# Altium schematic sheet 09_TFCARD&USB2.0.SchDoc
size A4; SheetNumber: 10; SheetTotal: 11
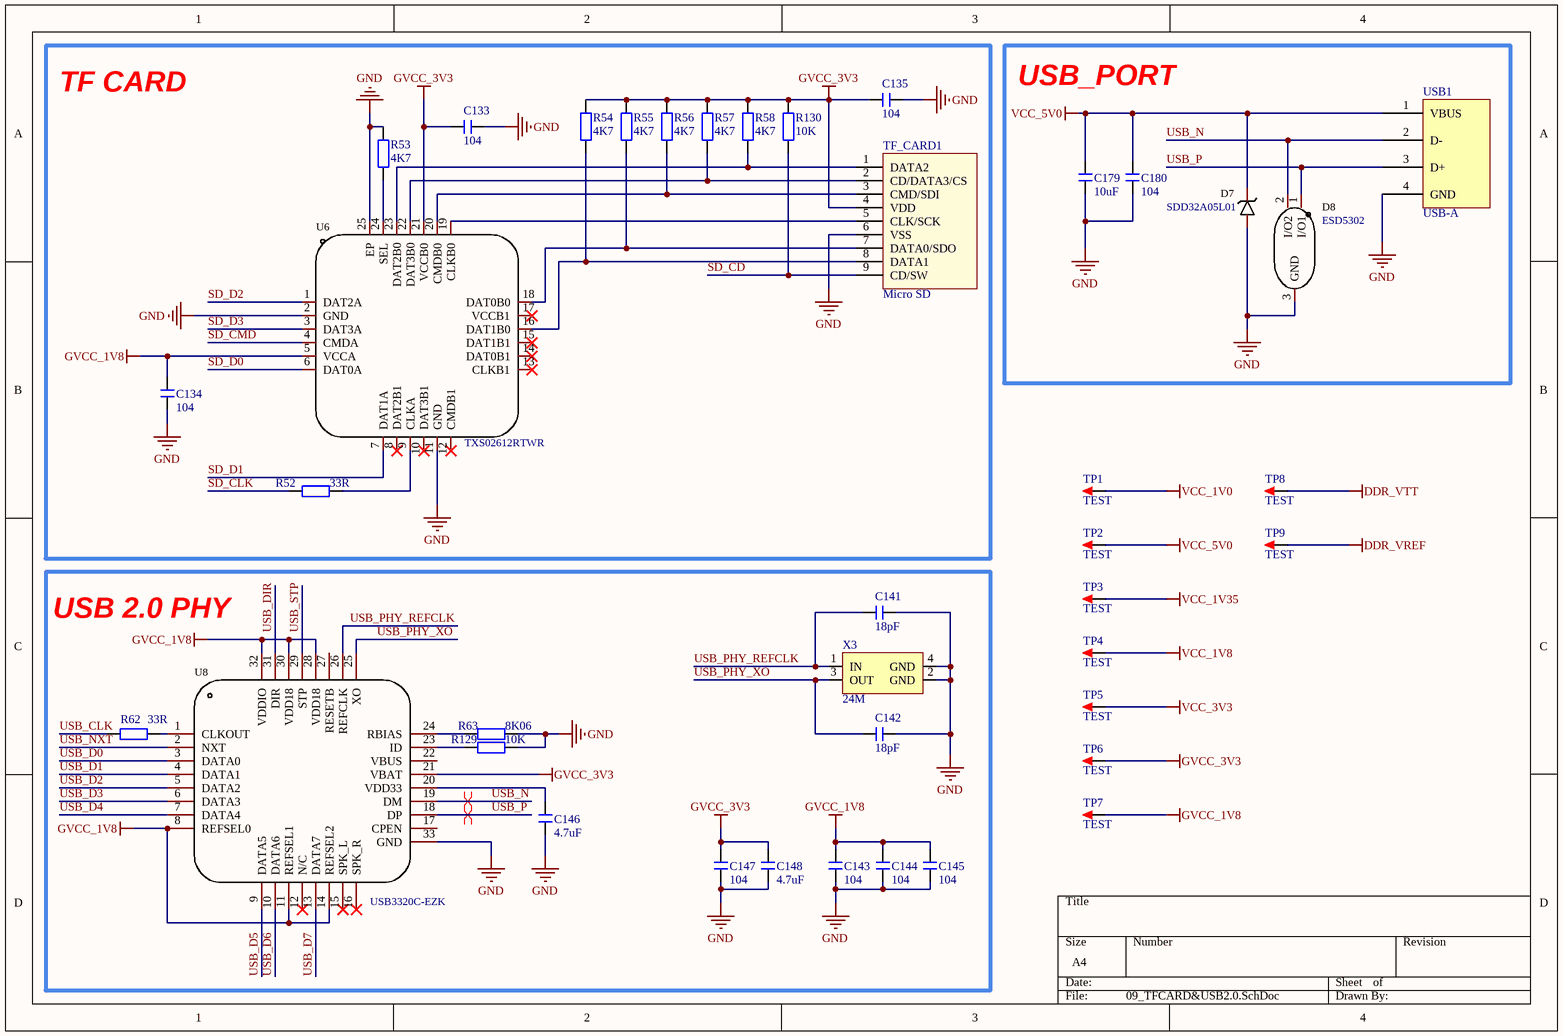
[diagram p0: 09_TFCARD&USB2.0.SchDoc]

## Parts
C133  104  [C 0603]
C134  104  [C 0603]
C135  104  [C 0603]
C141  18pF  [C 0603]
C142  18pF  [C 0603]
C143  104  [C 0603]
C144  104  [C 0603]
C145  104  [C 0603]
C146  4.7uF  [C 0603]
C147  104  [C 0603]
C148  4.7uF  [C 0603]
C179  10uF  [C 0805]
C180  104  [C 0603]
D7  SDD32A05L01  [SOD-323]
D8  ESD5302  [SOT23-3M]
R52  33R  [R 0603]
R53  4K7  [R 0603]
R54  4K7  [R 0603]
R55  4K7  [R 0603]
R56  4K7  [R 0603]
R57  4K7  [R 0603]
R58  4K7  [R 0603]
R62  33R  [R 0603]
R63  8K06  [R 0603]
R129  10K  [R 0603]
R130  10K  [R 0603]
TF_CARD1  Micro SD  [Micro SD]
TP1  TEST  [TEST 1]
TP2  TEST  [TEST 1]
TP3  TEST  [TEST 1]
TP4  TEST  [TEST 1]
TP5  TEST  [TEST 1]
TP6  TEST  [TEST 1]
TP7  TEST  [TEST 1]
TP8  TEST  [TEST 1]
TP9  TEST  [TEST 1]
U6  TXS02612RTWR  [QFN24 4x4_N]
U8  USB3320C-EZK  [QFN32 5x5_L]
USB1  USB-A  [USB-Short]
X3  24M  [XTAL-3225]

## Blocks framed on the sheet
TF CARD: C133-C135 R52-R58 R130 TF_CARD1 U6
USB_PORT: C179 C180 D7 D8 USB1
USB 2.0 PHY: C141-C148 R62 R63 R129 U8 X3

## Nets
DDR_VREF: TP9.1
DDR_VTT: TP8.1
GND: C133.1 C134.1 C135.2 C141.1 C142.1 C143.1 C144.1 C145.1 C146.1 C147.1 C148.1 C179.1 C180.1 D7.2(A) D8.3(GND) R53.2 R63.2 R129.2 TF_CARD1.6(VSS) U6.2(GND) U6.11(GND) U6.25(EP) U8.33(GND) USB1.4(GND) X3.2(GND) X3.4(GND)
GVCC_1V8: C134.2 C143.2 C144.2 C145.2 TP7.1 U6.5(VCCA) U8.8(REFSEL0) U8.11(REFSEL1) U8.14(REFSEL2) U8.28(VDD18) U8.30(VDD18) U8.32(VDDIO)
GVCC_3V3: C133.2 C135.1 C147.2 C148.2 R54.2 R55.2 R56.2 R57.2 R58.2 R130.2 TF_CARD1.4(VDD) TP6.1 U6.21(VCCB0) U8.21(VBAT)
VCC_1V0: TP1.1
VCC_1V8: TP4.1
VCC_1V35: TP3.1
VCC_3V3: TP5.1
VCC_5V0: C179.2 C180.2 D7.1(C) TP2.1 USB1.1(VBUS)
SD_CD: R130.1 TF_CARD1.9(CD/SW)
SD_CLK: R52.1
SD_CMD: U6.4(CMDA)
SD_D0: U6.6(DAT0A)
SD_D1: U6.7(DAT1A)
SD_D2: U6.1(DAT2A)
SD_D3: U6.3(DAT3A)
USB_CLK: R62.2
USB_D0: U8.3(DATA0)
USB_D1: U8.4(DATA1)
USB_D2: U8.5(DATA2)
USB_D3: U8.6(DATA3)
USB_D4: U8.7(DATA4)
USB_D5: U8.9(DATA5)
USB_D6: U8.10(DATA6)
USB_D7: U8.13(DATA7)
USB_DIR: U8.31(DIR)
USB_N: D8.2(I/O2) U8.19(DM) USB1.2(D-)
USB_NXT: U8.2(NXT)
USB_P: D8.1(I/O1) U8.18(DP) USB1.3(D+)
USB_PHY_REFCLK: C141.2 U8.26(REFCLK) X3.1(IN)
USB_PHY_XO: C142.2 U8.25(XO) X3.3(OUT)
USB_STP: U8.29(STP)
NetC146_2: C146.2 U8.20(VDD33)
NetR52_2: R52.2 U6.9(CLKA)
NetR53_1: R53.1 U6.24(SEL)
NetR54_1: R54.1 TF_CARD1.8(DATA1) U6.16(DAT1B0)
NetR55_1: R55.1 TF_CARD1.7(DATA0/SDO) U6.18(DAT0B0)
NetR56_1: R56.1 TF_CARD1.3(CMD/SDI) U6.20(CMDB0)
NetR57_1: R57.1 TF_CARD1.2(CD/DATA3/CS) U6.22(DAT3B0)
NetR58_1: R58.1 TF_CARD1.1(DATA2) U6.23(DAT2B0)
NetR62_1: R62.1 U8.1(CLKOUT)
NetR63_1: R63.1 U8.24(RBIAS)
NetR129_1: R129.1 U8.23(ID)
NetTF_CARD1_5: TF_CARD1.5(CLK/SCK) U6.19(CLKB0)

Not connected (* = marked no-connect by the designer): U6 8(DAT2B1)* 10(DAT3B1)* 12(CMDB1)* 13(CLKB1)* 14(DAT0B1)* 15(DAT1B1)* 17(VCCB1)*; U8 12(N/C)* 15(SPK_L)* 16(SPK_R)* 17(CPEN) 22(VBUS) 27(RESETB)

## Layout directives
differential pair: USB_N, USB_P

## Library data of the parts
C133-C135 C141-C148 C179 C180 = C: 无极性贴片电容; 版权归属: 源创客; BOM名称: 无极性贴片电容; 学习资源: www.ooocke.com
D7 = SDD32A05L01: Manufacturer: Brightking(君耀电子); Add into BOM: yes; Polarity: 单向; Number of Lines: 1; Reverse Stand-Off Voltage (Vrwm): 5V; Breakdown Voltage (VBR): 6V; Peak Pulse Current(Ipp)@8/20us: 24A; Clamping Voltage@Ipp: 9.8V; Name: SDD32A05L01; Symbol: SDD32A05L01; Device: SDD32A05L01; LCSC Part Name: 单向ESD; Supplier Part: C313305; Manufacturer Part: SDD32A05L01; Supplier Footprint: SOD-323; JLCPCB Part Class: Extended Part; Datasheet: https://atta.szlcsc.com/upload/public/pdf/source/20181015/C313305_BF914637BD71FE225247645F09645EA8.pdf; Supplier: LCSC; Convert to PCB: yes
D8 = ESD5302: Manufacturer: MSKSEMI(美森科); Name: ESD5302F-MS; Add into BOM: yes; Symbol: ESD5302F-MS; Device: ESD5302F-MS; LCSC Part Name: TVS管 W02F; Supplier Part: C2836381; Manufacturer Part: ESD5302F-MS; Supplier Footprint: SOT-23(TO-236); JLCPCB Part Class: Extended Part; Datasheet: https://atta.szlcsc.com/upload/public/pdf/source/20210623/C2836381_4BDAA47FAEBAACD9684711FE62D912DD.pdf; Supplier: LCSC; Convert to PCB: yes
R52-R58 R62 R63 R129 R130 = R: 贴片电阻; 版权归属: 源创客; BOM名称: 贴片电阻; 学习资源: www.ooocke.com
TF_CARD1 = Micro SD: Micro SD卡; 版权归属: 源创客; BOM名称: Micro SD卡; 学习资源: www.ooocke.com
TP1-TP9 = TEST: 测试点; 版权归属: 源创客; BOM名称: 测试点; 学习资源: www.ooocke.com
U6 = TXS02612RTWR: Manufacturer: TI(德州仪器); Add into BOM: yes; Name: TXS02612RTWR; Symbol: TXS02612RTWR; Device: TXS02612RTWR; LCSC Part Name: TXS02612RTWR; Supplier Part: C140276; Manufacturer Part: TXS02612RTWR; Supplier Footprint: QFN-24-EP(4x4); JLCPCB Part Class: Extended Part; Datasheet: https://www.ti.com/cn/lit/gpn/txs02612; Supplier: LCSC; Convert to PCB: yes
U8 = USB3320C-EZK: Manufacturer: MICROCHIP(美国微芯); Add into BOM: yes; Applications Function: 收发器; Protocol: USB 2.0; Supply Voltage: 1.8V~3.3V; Name: USB3320C-EZK; Symbol: USB3320C-EZK; Device: USB3320C-EZK; LCSC Part Name: 高度集成全功能高速usb2.0 ULPI收发器; Supplier Part: C52447; Manufacturer Part: USB3320C-EZK; Supplier Footprint: QFN-32-EP(5x5); JLCPCB Part Class: Extended Part; Datasheet: https://atta.szlcsc.com/upload/public/pdf/source/20210326/C52447_82C15BC01EB7B75485FAEA128A6533A1.pdf; Supplier: LCSC; Convert to PCB: yes; Operating Temperature: -40℃~+85℃
X3 = XTAL-4P: 4脚无源晶振; BOM名称: 4脚晶振; 版权归属: 源创客; 学习资源: www.ooocke.com